# Altium schematic sheet SH7 - MICROCONTROLLER.SchDoc: Microcontroller
size B; Engineer: Farris Matar; Organization: UW Robotics; Address1: 200 University Avenue; Address2: Waterloo; Address3: Ontario; Address4: Canada N2L 3G6; DocumentNumber: 7; Revision: 3; SheetNumber: 7; SheetTotal: 9
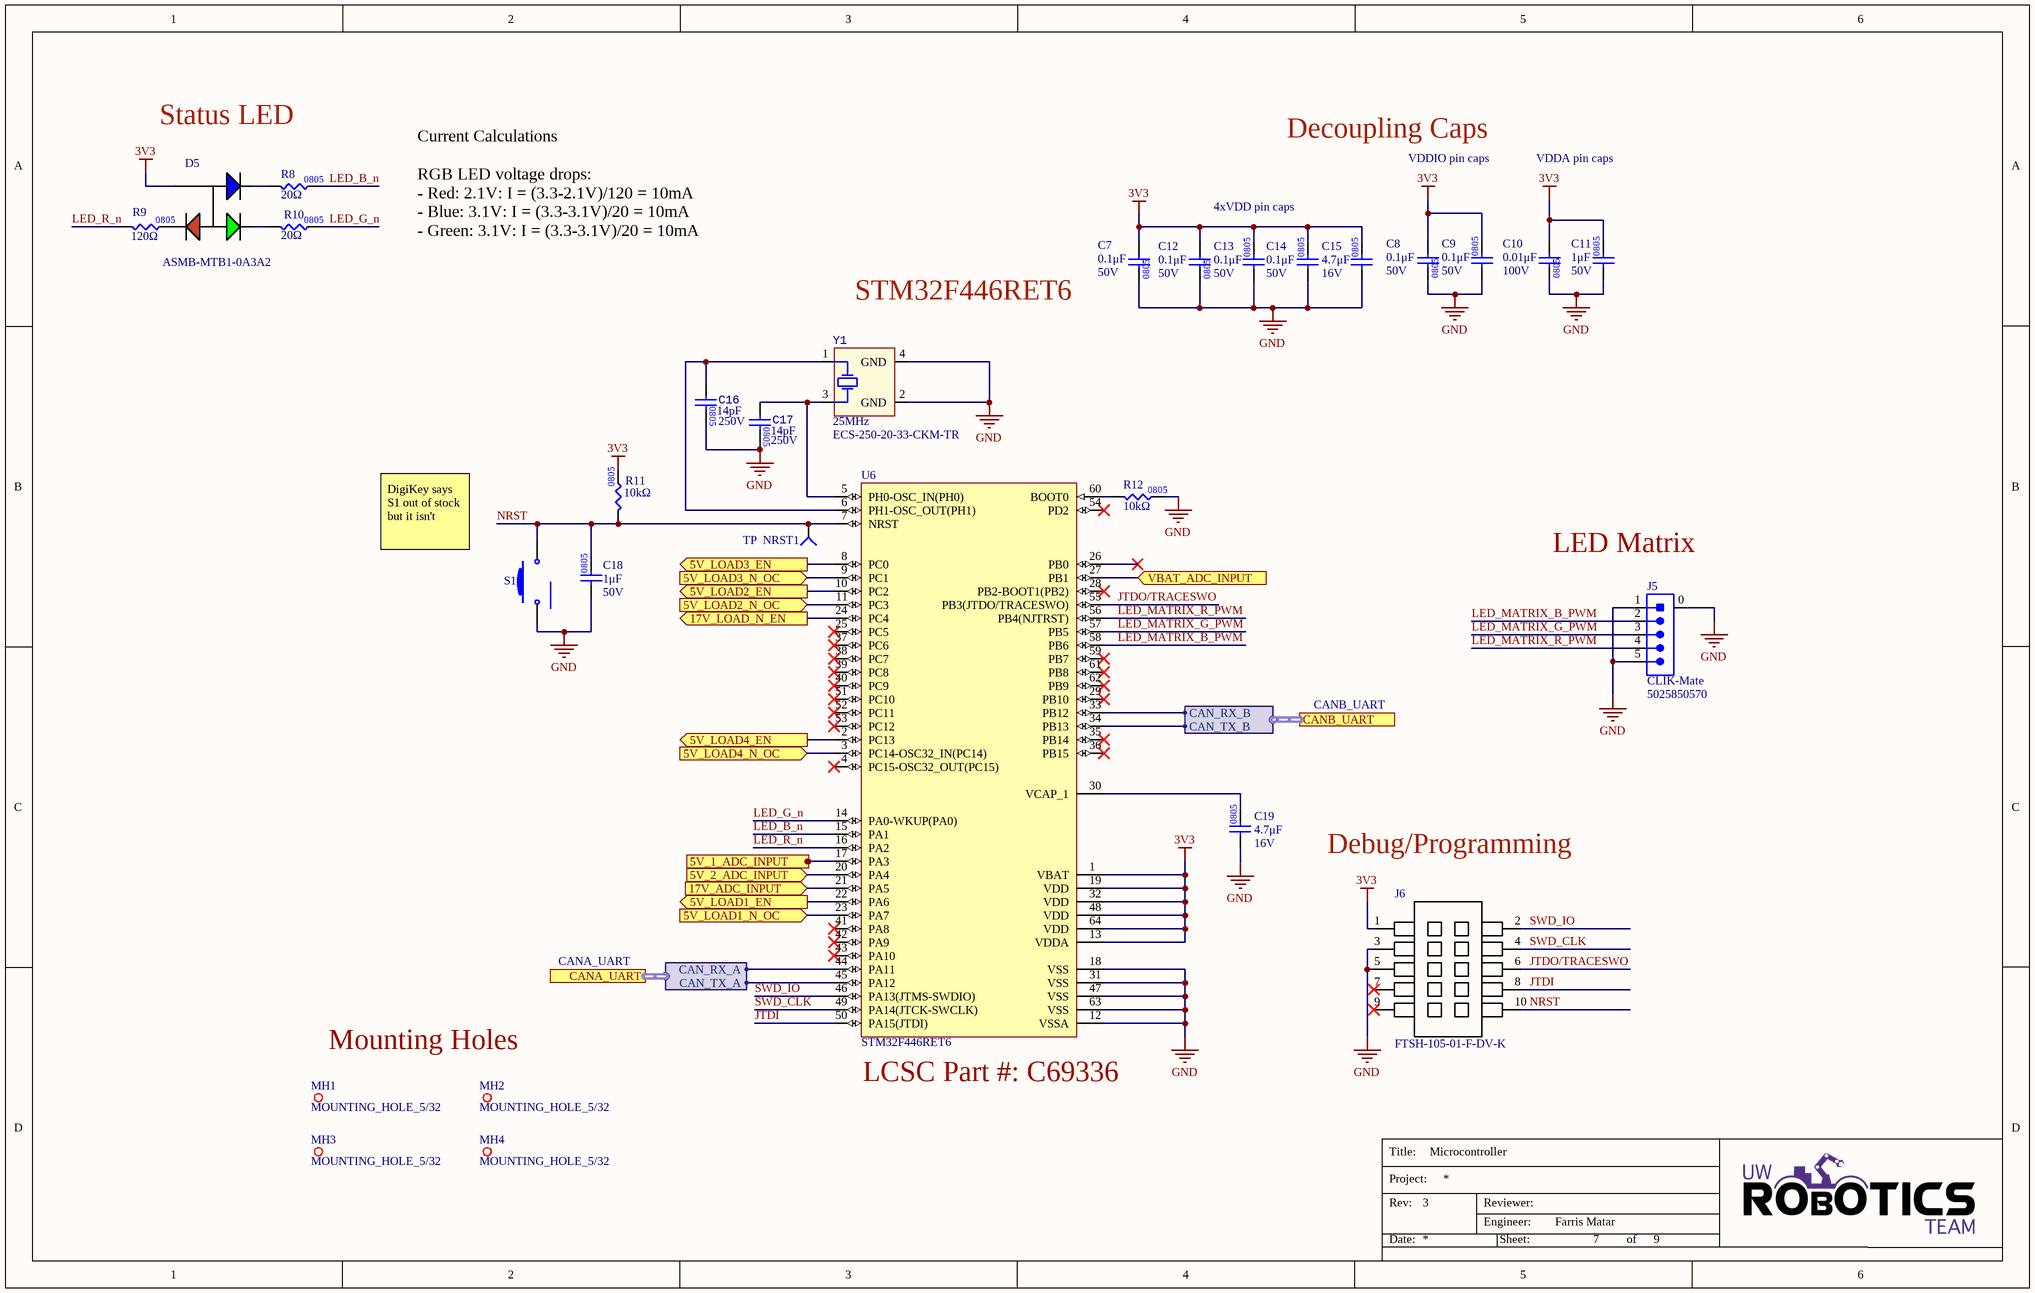
[diagram p0: SH7 - MICROCONTROLLER.SchDoc]

## Parts
C7  value 0.1μF  Voltage Rating: 50V  [CAP2012]  (hidden comment: CAP_0.1uF_50V_0805)
C8  value 0.1μF  Voltage Rating: 50V  [CAP2012]  (hidden comment: CAP_0.1uF_50V_0805)
C9  value 0.1μF  Voltage Rating: 50V  [CAP2012]  (hidden comment: CAP_0.1uF_50V_0805)
C10  value 0.01μF  Voltage Rating: 100V  [CAP0805]  (hidden comment: CAP_0.01uF_100V_0805)
C11  value 1μF  Voltage Rating: 50V  [CAP2012]  (hidden comment: CAP_1uF_50V_0805)
C12  value 0.1μF  Voltage Rating: 50V  [CAP2012]  (hidden comment: CAP_0.1uF_50V_0805)
C13  value 0.1μF  Voltage Rating: 50V  [CAP2012]  (hidden comment: CAP_0.1uF_50V_0805)
C14  value 0.1μF  Voltage Rating: 50V  [CAP2012]  (hidden comment: CAP_0.1uF_50V_0805)
C15  value 4.7μF  Voltage Rating: 16V  [CAP0805]  (hidden comment: CAP_4.7uF_16V_0805)
C16  value 14pF  Voltage Rating: 250V  [CAP0805]  (hidden comment: CAP_14pF_50V_0805)
C17  value 14pF  Voltage Rating: 250V  [CAP0805]  (hidden comment: CAP_14pF_50V_0805)
C18  value 1μF  Voltage Rating: 50V  [CAP2012]  (hidden comment: CAP_1uF_50V_0805)
C19  value 4.7μF  Voltage Rating: 16V  [CAP0805]  (hidden comment: CAP_4.7uF_16V_0805)
D5  Manufacturer Part Number 1: ASMB-MTB1-0A3A2  [LED_RGB]  (hidden comment: LED_RGB)
J5  Family: CLIK-Mate  Manufacturer Part Number 1: 5025850570  [MOLEX-5025850570]  (hidden comment: CON_5M_SM_RA)
J6  Manufacturer Part Number 1: FTSH-105-01-F-DV-K  [FTSH-105-01-F-DV-K-P-TR]  (hidden comment: CON_PROGRAMMING)
MH1  MOUNTING_HOLE_5/32  [MOUNTING_HOLE_5/38]  (no BOM)
MH2  MOUNTING_HOLE_5/32  [MOUNTING_HOLE_5/38]  (no BOM)
MH3  MOUNTING_HOLE_5/32  [MOUNTING_HOLE_5/38]  (no BOM)
MH4  MOUNTING_HOLE_5/32  [MOUNTING_HOLE_5/38]  (no BOM)
R8  value 20Ω  [RES0805]  (hidden comment: RES_20Ω_0805_1%)
R9  value 120Ω  [RES0805]  (hidden comment: RES_120Ω_0805_1%)
R10  value 20Ω  [RES0805]  (hidden comment: RES_20Ω_0805_1%)
R11  value 10kΩ  [RES0805]  (hidden comment: RES_10kΩ_0805_5%)
R12  value 10kΩ  [RES0805]  (hidden comment: RES_10kΩ_0805_5%)
S1  SW_PUSHBUTTON  [TACTILE_SWITCH_SMD]  (value not drawn)
TP_NRST1  TESTPOINT_1MM_CIRCLE  [TESTPOINT_CIRCLE_1MM]  (value not drawn)  (no BOM)
U6  STM32F446RET6  [STM-LQFP64_L]
Y1  Frequency: 25MHz  Manufacturer Part Number 1: ECS-250-20-33-CKM-TR  [XTAL_ECS-250-20-33-CKM-TR]  (hidden comment: CRYSTAL_25MHZ_20PF)

## Ports
5V_1_ADC_INPUT (in), 5V_2_ADC_INPUT (in), 5V_LOAD1_EN (out), 5V_LOAD1_N_OC (in), 5V_LOAD2_EN (out), 5V_LOAD2_N_OC (in), 5V_LOAD3_EN (out), 5V_LOAD3_N_OC (in), 5V_LOAD4_EN (out), 5V_LOAD4_N_OC (in), 17V_ADC_INPUT (in), 17V_LOAD_N_EN (out), CANA_UART (harness CANA_UART), CANB_UART (harness CANB_UART), VBAT_ADC_INPUT (in)

## Harnesses
CANA_UART: CAN_RX_A, CAN_TX_A
CANB_UART: CAN_RX_B, CAN_TX_B

## Nets
3V3: C7.2 C8.2 C9.2 C10.2 C11.2 C12.2 C13.2 C14.2 C15.2 D5.4(COMMON_ANODE) J6.1 R11.2 U6.1(VBAT) U6.13(VDDA) U6.19(VDD) U6.32(VDD) U6.48(VDD) U6.64(VDD)
GND: C7.1 C8.1 C9.1 C10.1 C11.1 C12.1 C13.1 C14.1 C15.1 C16.2 C17.2 C18.1 C19.1 J5.0 J5.1 J5.5 J6.3 J6.5 R12.2 S1.1 U6.12(VSSA) U6.18(VSS) U6.31(VSS) U6.47(VSS) U6.63(VSS) Y1.2(GND) Y1.4(GND)
5V_1_ADC_INPUT: U6.17(PA3) ; port 5V_1_ADC_INPUT
5V_2_ADC_INPUT: U6.20(PA4) ; port 5V_2_ADC_INPUT
5V_LOAD1_EN: U6.22(PA6) ; port 5V_LOAD1_EN
5V_LOAD1_N_OC: U6.23(PA7) ; port 5V_LOAD1_N_OC
5V_LOAD2_EN: U6.10(PC2) ; port 5V_LOAD2_EN
5V_LOAD2_N_OC: U6.11(PC3) ; port 5V_LOAD2_N_OC
5V_LOAD3_EN: U6.8(PC0) ; port 5V_LOAD3_EN
5V_LOAD3_N_OC: U6.9(PC1) ; port 5V_LOAD3_N_OC
5V_LOAD4_EN: U6.2(PC13) ; port 5V_LOAD4_EN
5V_LOAD4_N_OC: U6.3(PC14-OSC32_IN(PC14)) ; port 5V_LOAD4_N_OC
17V_ADC_INPUT: U6.21(PA5) ; port 17V_ADC_INPUT
17V_LOAD_N_EN: U6.24(PC4) ; port 17V_LOAD_N_EN
JTDI: J6.8 U6.50(PA15(JTDI))
JTDO/TRACESWO: J6.6 U6.55(PB3(JTDO/TRACESWO))
LED_B_n: R8.2 U6.15(PA1)
LED_G_n: R10.2 U6.14(PA0-WKUP(PA0))
LED_MATRIX_B_PWM: J5.2 U6.58(PB6)
LED_MATRIX_G_PWM: J5.3 U6.57(PB5)
LED_MATRIX_R_PWM: J5.4 U6.56(PB4(NJTRST))
LED_R_n: R9.1 U6.16(PA2)
NRST: C18.2 J6.10 R11.1 S1.2 TP_NRST1.1(=value) U6.7(NRST)
SWD_CLK: J6.4 U6.49(PA14(JTCK-SWCLK))
SWD_IO: J6.2 U6.46(PA13(JTMS-SWDIO))
VBAT_ADC_INPUT: U6.27(PB1) ; port VBAT_ADC_INPUT
NetC16_1: C16.1 U6.6(PH1-OSC_OUT(PH1)) Y1.1(HOT)
NetC17_1: C17.1 U6.5(PH0-OSC_IN(PH0)) Y1.3(HOT)
NetC19_2: C19.2 U6.30(VCAP_1)
NetD5_1: D5.1(CATHODE_(RED)) R9.2
NetD5_2: D5.2(CATHODE_(GREEN)) R10.1
NetD5_3: D5.3(CATHODE_(BLUE)) R8.1
NetR12_1: R12.1 U6.60(BOOT0)
NetU6_33: U6.33(PB12) ; port CANB_UART.CAN_RX_B
NetU6_34: U6.34(PB13) ; port CANB_UART.CAN_TX_B
NetU6_44: U6.44(PA11) ; port CANA_UART.CAN_RX_A
NetU6_45: U6.45(PA12) ; port CANA_UART.CAN_TX_A

Not connected (* = marked no-connect by the designer): J6 7* 9*; U6 4(PC15-OSC32_OUT(PC15))* 25(PC5)* 26(PB0)* 28(PB2-BOOT1(PB2))* 29(PB10)* 35(PB14)* 36(PB15)* 37(PC6)* 38(PC7)* 39(PC8)* 40(PC9)* 41(PA8)* 42(PA9)* 43(PA10)* 51(PC10)* 52(PC11)* 53(PC12)* 54(PD2)* 59(PB7)* 61(PB8)* 62(PB9)*

## Notes on the sheet
- Status LED
- Decoupling Caps
- VDDIO pin caps
- VDDA pin caps
- 4xVDD pin caps
- Current Calculations
  RGB LED voltage drops:
  - Red: 2.1V: I = (3.3-2.1V)/120 = 10mA
  - Blue: 3.1V: I = (3.3-3.1V)/20 = 10mA
  - Green: 3.1V: I = (3.3-3.1V)/20 = 10mA
- STM32F446RET6
- DigiKey says S1 out of stock but it isn't
- (near J5) LED Matrix
- Debug/Programming
- Mounting Holes
- (near U6) LCSC Part #: C69336
- Title:
- Project:
- Date:
- Rev:
- Reviewer:
- Engineer:
- Sheet:
- of

## Library data of the parts
C7-C9 C12-C14 = CAP_0.1uF_50V_0805: CAP CER 0.1UF 50V X7R 0805; Manufacturer Part Number 1: GCM21BR71H104KA37K; Manufacturer 1: Murata Electronics; Package/Footprint: 0805; Supplier Part Number 1: 490-8049-1-ND; Supplier 1: Digi-Key; Dielectric: X7R; LCSC Part #: C49678; Mounting Type: SMD
C10 = CAP_0.01uF_100V_0805: CAP CER 0.01uF 100V X7R 0805; Manufacturer Part Number 1: 08051C103KAT2A; Manufacturer 1: AVX Corporation; Supplier Part Number 1: 478-1358-1-ND; Supplier 1: Digi-Key; Dielectric: X7R; LCSC Part #: C1710; Mounting Type: SMD; Package: 0805
C11 C18 = CAP_1uF_50V_0805: CAP CER 1UF 50V X7R 0805; Manufacturer 1: Samsung Electro-Mechanics; Manufacturer Part Number 1: CL21B105KBFNNNG; Supplier Part Number 1: 1276-6470-1-ND; Supplier 1: Digi-Key; LCSC Part #: C28323; Mounting Type: SMD; Package: 0805
C15 C19 = CAP_4.7uF_16V_0805: CAP CER 4.7UF 16V X5R 0805; Manufacturer Part Number 1: CL21A475KOFNNNE; Manufacturer 1: Samsung Electro-Mechanics; Supplier Part Number 1: 1276-1065-1-ND; Supplier 1: Digi-Key; Dielectric: X5R; LCSC Part #: C1779; Mounting Type: SMD; Package: 0805
C16 C17 = CAP_14pF_50V_0805: CERAMIC CAP MLCC HIGH-Q 125C; Manufacturer: Murata Electronics; Manufacturer Part Number: GQM2195C2E140JB12D; Mounting Type: SMD; Package: 0805; Supplier 1: Digi-Key; Supplier Part Number 1: 490-GQM2195C2E140JB12DCT-ND
D5 = LED_RGB: LED RGB DIFFUSED 4PLCC SMD; Manufacturer 1: Broadcom; Color: Blue,Green,Red; Lens Color: White; Viewing Angle: 115°; Lens Style: Round; Luminous Intensity: 350mcd; Dominant Wavelength: 470nm; Forward Voltage: 3.1V; Test Current: 20mA; Package/Footprint: 4-PLCC; Supplier 1: Digi-Key; Number of Pins: 4; Lens Transparency: Diffused; Supplier Part Number 1: 516-3280-1-ND; Mounting Type: SMD
J5 = CON_5M_SM_RA: CONN HEADER SMD RIGHT ANGLE 1.5MM PITCH; Manufacturer 1: Molex; Current Rating: 2A; Supplier 1: Digi-Key; Supplier Part Number 1: WM14469CT-ND; Orientation: Right Angle; Mounting Type: SMD; Package/Footprint: SMD
J6 = CON_PROGRAMMING: CONN HEADER SMD 10POS 1.27MM; Manufacturer 1: Samtec; Supplier 1: Digi-Key; Pitch: 1.27mm; Supplier Part Number 1: SAM8796-ND; Mounting Type: SMD
R8 R10 = RES_20Ω_0805_1%: RES 20 OHM 1% 1/8W 0805; Manufacturer 1: Yageo; Manufacturer Part Number 1: RC0805FR-0720RL; Supplier Part Number 1: 311-20.0CRCT-ND; Supplier 1: Digi-Key; LCSC Part #: C17581; Mounting Type: SMD; Package: 0805
R9 = RES_120Ω_0805_1%: RES 120 OHM 1% 1/8W 0805; Manufacturer 1: Vishay; Manufacturer Part Number 1: CRCW0805120RFKEA; Package/Footprint: 0805; Supplier Part Number 1: 541-120CCT-ND; Supplier 1: Digi-Key; LCSC Part #: C17437; Mounting Type: SMD
R11 R12 = RES_10kΩ_0805_5%: RES 10K OHM 5% 1/8W 0805; Manufacturer 1: Panasonic Electronic Components; Manufacturer Part Number 1: ERJ-6GEYJ103V; Package/Footprint: 0805; Supplier Part Number 1: P10KACT-ND; Supplier 1: Digi-Key; LCSC Part #: C17414; Mounting Type: SMD
S1 = SW_PUSHBUTTON: SMT 3.0 X 2.6 MM TACT SWITCH WIT; Manufacturer Part Number 1: 435151014824; Manufacturer 1: Würth Elektronik; Supplier 1: Digi-Key; Supplier Part Number 1: 732-435151014824CT-ND
TP_NRST1 = TESTPOINT_1MM_CIRCLE: TESTPOINT 1MM CIRCLE
U6 = MCU_STM32F446RET6: ARM Cortex-M4 32-bit MCU+FPU, 512 KB Flash, 128 KB Internal RAM, 50 I/Os, 64-Pin LQFP, -40 to 85 degC, Tray; I/Os (High Current): 50; Supply Voltage(Vcc) min (V): 1.7; Operating Frequency(F) (Processor speed) (MHz): 180; D/A Converter: 2; Internal RAM Size (kB): 128; FLASH Size (Prog) (kB): 512; Core: ARM Cortex-M4; ComponentLink1Description: Manufacturer URL; Package Reference: 64-Pin Low-profile Quad Flat Package, Body 10 x 10 mm, Pitch 0.5 mm; ComponentLink2URL: http://www.st.com/st-web-ui/static/active/en/resource/technical/document/datasheet/DM00141306.pdf; Packing: Tray; DatasheetVersion: Rev. 6; ComponentLink1URL: http://www.st.com/; ComponentLink2Description: Datasheet; Package Description: LQFP64; Mounting Technology: Surface Mount; Supplier Part Number 1: 497-15376-ND; Supplier 1: Digi-Key
Y1 = CRYSTAL_25MHZ_20PF: CRYSTAL 25.0000MHZ 20PF SMD; Manufacturer 1: ECS Inc.; Load Capacitance: 20pF; Supplier 1: Digi-Key; Supplier Part Number 1: XC1817CT-ND; Mounting Type: SMD; Package/Footprint: SMD